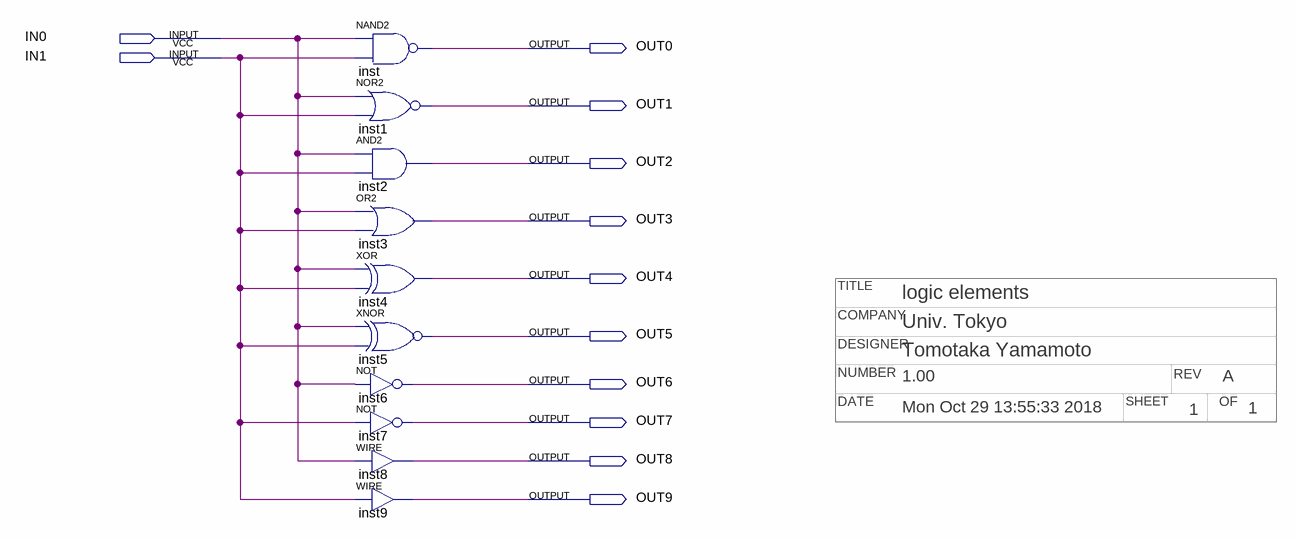
[diagram p0: schematic sheet]
// Quartus schematic a01_logicelements.bdf as structural Verilog: 10 symbols, 12 pins
// Title block: COMPANY: Univ. Tokyo; DATE: Mon Oct 29 13:55:33 2018; DESIGNER: Tomotaka Yamamoto; NUMBER: 1.00; OF: 1; REV: A; SHEET: 1; TITLE: logic elements
module a01_logicelements (
  input  IN0,
  input  IN1,
  output OUT0,
  output OUT1,
  output OUT2,
  output OUT3,
  output OUT4,
  output OUT5,
  output OUT6,
  output OUT7,
  output OUT8,
  output OUT9
);

  nand inst (OUT0, IN0, IN1);
  nor inst1 (OUT1, IN0, IN1);
  and inst2 (OUT2, IN0, IN1);
  or inst3 (OUT3, IN0, IN1);
  xor inst4 (OUT4, IN0, IN1);
  xnor inst5 (OUT5, IN0, IN1);
  not inst6 (OUT6, IN0);
  not inst7 (OUT7, IN1);
  assign OUT8 = IN0;  // WIRE inst8
  assign OUT9 = IN1;  // WIRE inst9
endmodule
